# EAGLE schematic Blueboard_Pro_v1.1 (EAGLE 6.3)
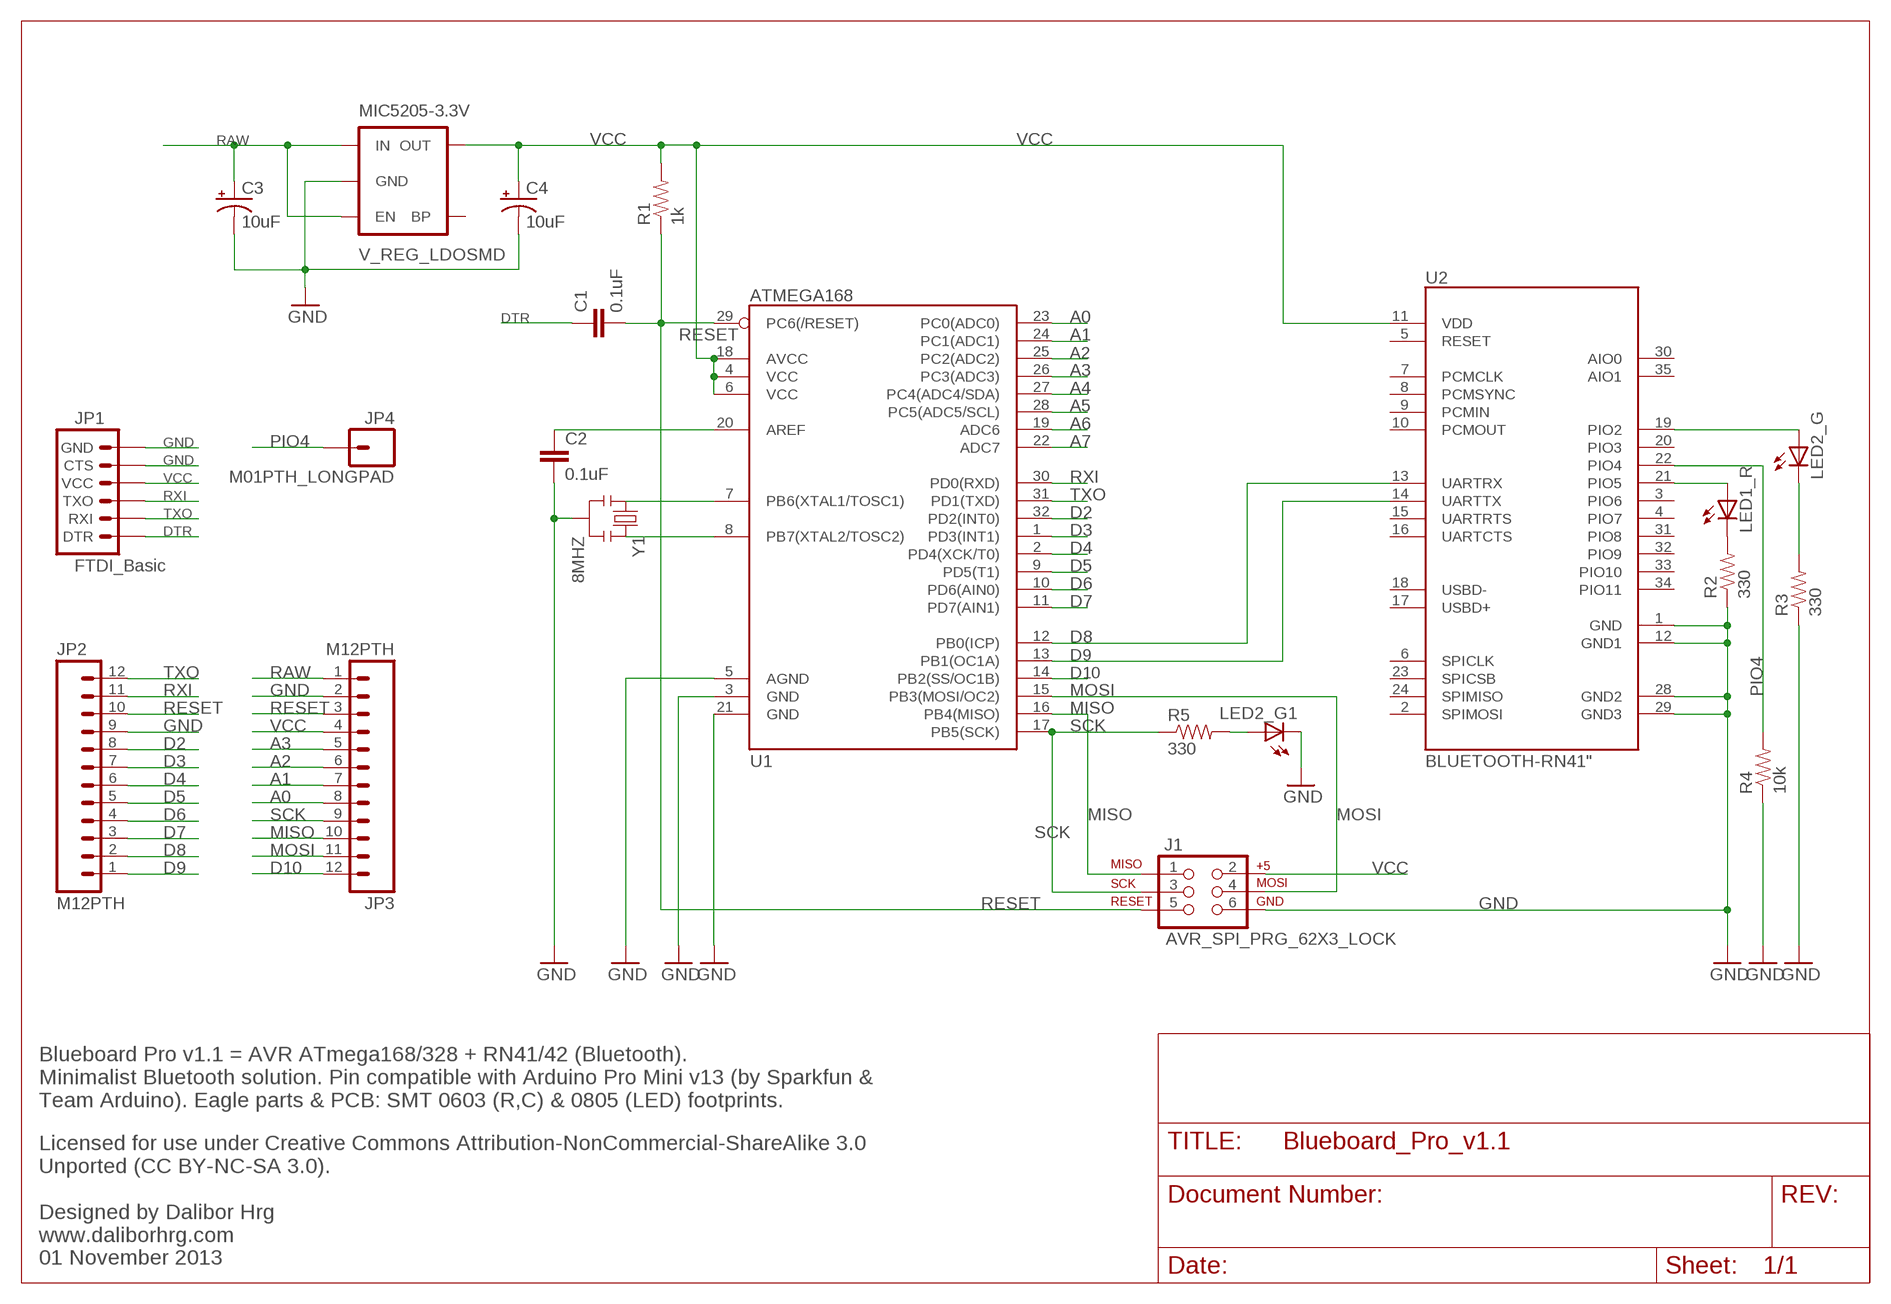
[diagram p0: schematic, sheet 1]

## Parts
C1  0.1uF  CAP0603-CAP  [0603-CAP]
C2  0.1uF  CAP0603-CAP  [0603-CAP]
C3  10uF  10UF-16V-10%(TANT)  [EIA3216]
C4  10uF  10UF-16V-10%(TANT)  [EIA3216]
J1  AVR_SPI_PRG_62X3_LOCK  [2X3_LOCK]
JP1  FTDI_Basic  ARDUINO_SERIAL_PROGRAMPTH  [1X06]
JP2  M12PTH  [1X12]
JP3  M12PTH  [1X12]
JP4  M01PTH_LONGPAD  [1X01_LONGPAD]
LED1_R  LEDCHIP-LED0805  [CHIP-LED0805]
LED2_G  LEDCHIP-LED0805  [CHIP-LED0805]
LED2_G1  LEDCHIP-LED0805  [CHIP-LED0805]
MIC5205-3.3V  V_REG_LDOSMD  [SOT23-5]
R1  1k  1K-1%  [0603-RES]
R2  330  RESISTOR0603-RES  [0603-RES]
R3  330  RESISTOR0603-RES  [0603-RES]
R4  10k  RESISTOR0603  [0603-RES]
R5  330  RESISTOR0603-RES  [0603-RES]
U1  ATMEGA168  [TQFP32-08]
U2  BLUETOOTH-RN41"  [RN41]
Y1  8MHZ  RESONATOR8MHZ  [RESONATOR-SMD]

## Nets
A0: JP3.8 U1.23(PC0(ADC0))
A1: JP3.7 U1.24(PC1(ADC1))
A2: JP3.6 U1.25(PC2(ADC2))
A3: JP3.5 U1.26(PC3(ADC3))
A4: U1.27(PC4(ADC4/SDA))
A5: U1.28(PC5(ADC5/SCL))
A6: U1.19(ADC6)
A7: U1.22(ADC7)
D2: JP2.8 U1.32(PD2(INT0))
D3: JP2.7 U1.1(PD3(INT1))
D4: JP2.6 U1.2(PD4(XCK/T0))
D5: JP2.5 U1.9(PD5(T1))
D6: JP2.4 U1.10(PD6(AIN0))
D7: JP2.3 U1.11(PD7(AIN1))
D8: JP2.2 U1.12(PB0(ICP)) U2.13(UARTRX)
D9: JP2.1 U1.13(PB1(OC1A)) U2.14(UARTTX)
D10: JP3.12 U1.14(PB2(SS/OC1B))
DTR: C1.1 JP1.1(DTR)
GND: C2.2 C3.C(-) C4.C(-) J1.6 JP1.5(CTS) JP1.6(GND) JP2.9 JP3.2 LED2_G1.C MIC5205-3.3V.2(GND) R2.1 R3.1 R4.1 U1.3(GND) U1.5(AGND) U1.21(GND) U2.1(GND) U2.12(GND1) U2.28(GND2) U2.29(GND3) Y1.2
MISO: J1.1 JP3.10 U1.16(PB4(MISO))
MOSI: J1.4 JP3.11 U1.15(PB3(MOSI/OC2))
N$1: LED2_G1.A R5.2
N$8: U1.7(PB6(XTAL1/TOSC1)) Y1.1
N$9: U1.8(PB7(XTAL2/TOSC2)) Y1.3
N$26: C2.1 U1.20(AREF)
N$38: LED1_R.A U2.21(PIO5)
N$39: LED1_R.C R2.2
N$40: LED2_G.C R3.2
N$41: LED2_G.A U2.19(PIO2)
PIO4: JP4.1 R4.2 U2.22(PIO4)
RAW: C3.A(+) JP3.1 MIC5205-3.3V.1(IN) MIC5205-3.3V.3(EN)
RESET: C1.2 J1.5 JP2.10 JP3.3 R1.1 U1.29(PC6(/RESET))
RXI: JP1.3(TXO) JP2.11 U1.30(PD0(RXD))
SCK: J1.3 JP3.9 R5.1 U1.17(PB5(SCK))
TXO: JP1.2(RXI) JP2.12 U1.31(PD1(TXD))
VCC: C4.A(+) J1.2 JP1.4(VCC) JP3.4 MIC5205-3.3V.5(OUT) R1.2 U1.4(VCC) U1.6(VCC) U1.18(AVCC) U2.11(VDD)
Unconnected: MIC5205-3.3V.4(BP) U2.2(SPIMOSI) U2.3(PIO6) U2.4(PIO7) U2.5(RESET) U2.6(SPICLK) U2.7(PCMCLK) U2.8(PCMSYNC) U2.9(PCMIN) U2.10(PCMOUT) U2.15(UARTRTS) U2.16(UARTCTS) U2.17(USBD+) U2.18(USBD-) U2.20(PIO3) U2.23(SPICSB) U2.24(SPIMISO) U2.30(AIO0) U2.31(PIO8) U2.32(PIO9) U2.33(PIO10) U2.34(PIO11) U2.35(AIO1)

## Notes on the sheet
- Blueboard Pro v1.1 = AVR ATmega168/328 + RN41/42 (Bluetooth). 
  Minimalist Bluetooth solution. Pin compatible with Arduino Pro Mini v13 (by Sparkfun & 
  Team Arduino). Eagle parts & PCB: SMT 0603 (R,C) & 0805 (LED) footprints.
- Licensed for use under Creative Commons Attribution-NonCommercial-ShareAlike 3.0
  Unported (CC BY-NC-SA 3.0).
  
  Designed by Dalibor Hrg
  www.daliborhrg.com
  01 November 2013

## Library data of the parts
C1 = SparkFun-Passives:CAP: Capacitor Standard 0603 ceramic capacitor, and 0.1" leaded capacitor.
C2 = SparkFun-Capacitors:CAP: Capacitor Standard 0603 ceramic capacitor, and 0.1" leaded capacitor.
C3 C4 = SparkFun-Capacitors:10UF-16V-10%(TANT): CAP-00811 1206/EIA-3216 Tantalum capacitor; PROD_ID: CAP-00811
J1 = SparkFun-Connectors:AVR_SPI_PRG_6: AVR ISP 6 Pin This is the reduced ISP connector for AVR programming. Common on Arduino. This footprint will take up less PCB space and can be used with a 10-pin to 6-pin adapter such as SKU: BOB-08508
JP1 = SparkFun-Connectors:ARDUINO_SERIAL_PROGRAM: FTDI connector footprints
JP2 JP3 = SparkFun-Connectors:M12: Header 12 Standard 12-pin 0.1" header. Use with straight break away headers (SKU : PRT-00116), right angle break away headers (PRT-00553), swiss pins (PRT-00743), machine pins (PRT-00117), and female headers (PRT-00115).
JP4 = SparkFun-Connectors:M01: Header 1 Standard 1-pin 0.1" header. Use with straight break away headers (SKU : PRT-00116), right angle break away headers (PRT-00553), swiss pins (PRT-00743), machine pins (PRT-00117), and female headers (PRT-00115).
LED1_R LED2_G LED2_G1 = adafruit:LED: LED OSRAM: - CHIPLED LG R971, LG N971, LY N971, LG Q971, LY Q971, LO R971, LY R971 LH N974, LH R974 LS Q976, LO Q976, LY Q976 LO Q996 - Hyper CHIPLED LW Q18S LB Q993, LB Q99A, LB R99A - SideLED LS A670, LO A670, LY A670, LG A670, LP A670 LB A673, LV A673, LT A673, LW A673 LH A674 LY A675 LS A676, LA A676, LO A676, LY A676, LW A676 LS A679, LY A679, LG A679 - Hyper Micro SIDELED® LS Y876, LA Y876, LO Y876, LY Y876 LT Y87S - SmartLED LW L88C, LW L88S LB L89C, LB L89S, LG L890 LS L89K, LO L89K, LY L89K LS L896, LA L896, LO L896, LY L896 - TOPLED LS T670, LO T670, LY T670, LG T670, LP T670 LSG T670, LSP T670, LSY T670, LOP T670, LYG T670 LG T671, LOG T671, LSG T671 LB T673, LV T673, LT T673, LW T673 LH T674 LS T676, LA T676, LO T676, LY T676, LB T676, LH T676, LSB T676, LW T676 LB T67C, LV T67C, LT T67C, LS T67K, LO T67K, LY T67K, LW E67C LS E67B, LA E67B, LO E67B, LY E67B, LB E67C, LV E67C, LT E67C LW T67C LS T679, LY T679, LG T679 LS T770, LO T770, LY T770, LG T770, LP T770 LB T773, LV T773, LT T773, LW T773 LH T774 LS E675, LA E675, LY E675, LS T675 LS T776, LA T776, LO T776, LY T776, LB T776 LHGB T686 LT T68C, LB T68C - Hyper Mini TOPLED® LB M676 - Mini TOPLED Santana® LG M470 LS M47K, LO M47K, LY M47K Source: http://www.osram.convergy.de/
MIC5205-3.3V = SparkFun-PowerIC:V_REG_LDO: Voltage Regulator LDO Standard 150mA LDO voltage regulator in SOT-23 layout. Micrel part MIC5205. BP (by-pass) pin is used to lower output noise with 470pF cap.
R1 = SparkFun-Resistors:1K-1%: 1k-ohm SMT 1/10W - 1% (0603) RES-07856; PROD_ID: RES-07856
R2 R3 R5 = SparkFun-Passives:RESISTOR: Resistor Basic schematic elements and footprints for 0603, 1206, and PTH resistors.
R4 = SparkFun-Resistors:RESISTOR: Resistor Basic schematic elements and footprints for 0603, 1206, and PTH resistors.
U1 = SparkFun-DigitalIC:ATMEGA168: Atmel 32-pin 8-bit micro, 16k flash.
U2 = SparkFun-RF:BLUETOOTH-RN41: Bluetooth SMD module
Y1 = SparkFun-FreqCtrl:RESONATOR: Resonator Small SMD resonator. Used, eg, on the Arduino Pro/ Pro Mini boards. 8MHz- XTAL-08895 16MHz- XTAL-08900; PROD_ID: XTAL-08895